# EasyEDA Pro project ProPrj_Devboard_V2_2025-07-15.epro, schematic Schematic1, sheets 4 to 7 of 7

## Sheets
4 P4: Create Date: 2025-06-23; Page Name: P4; Update Date: 2025-07-11
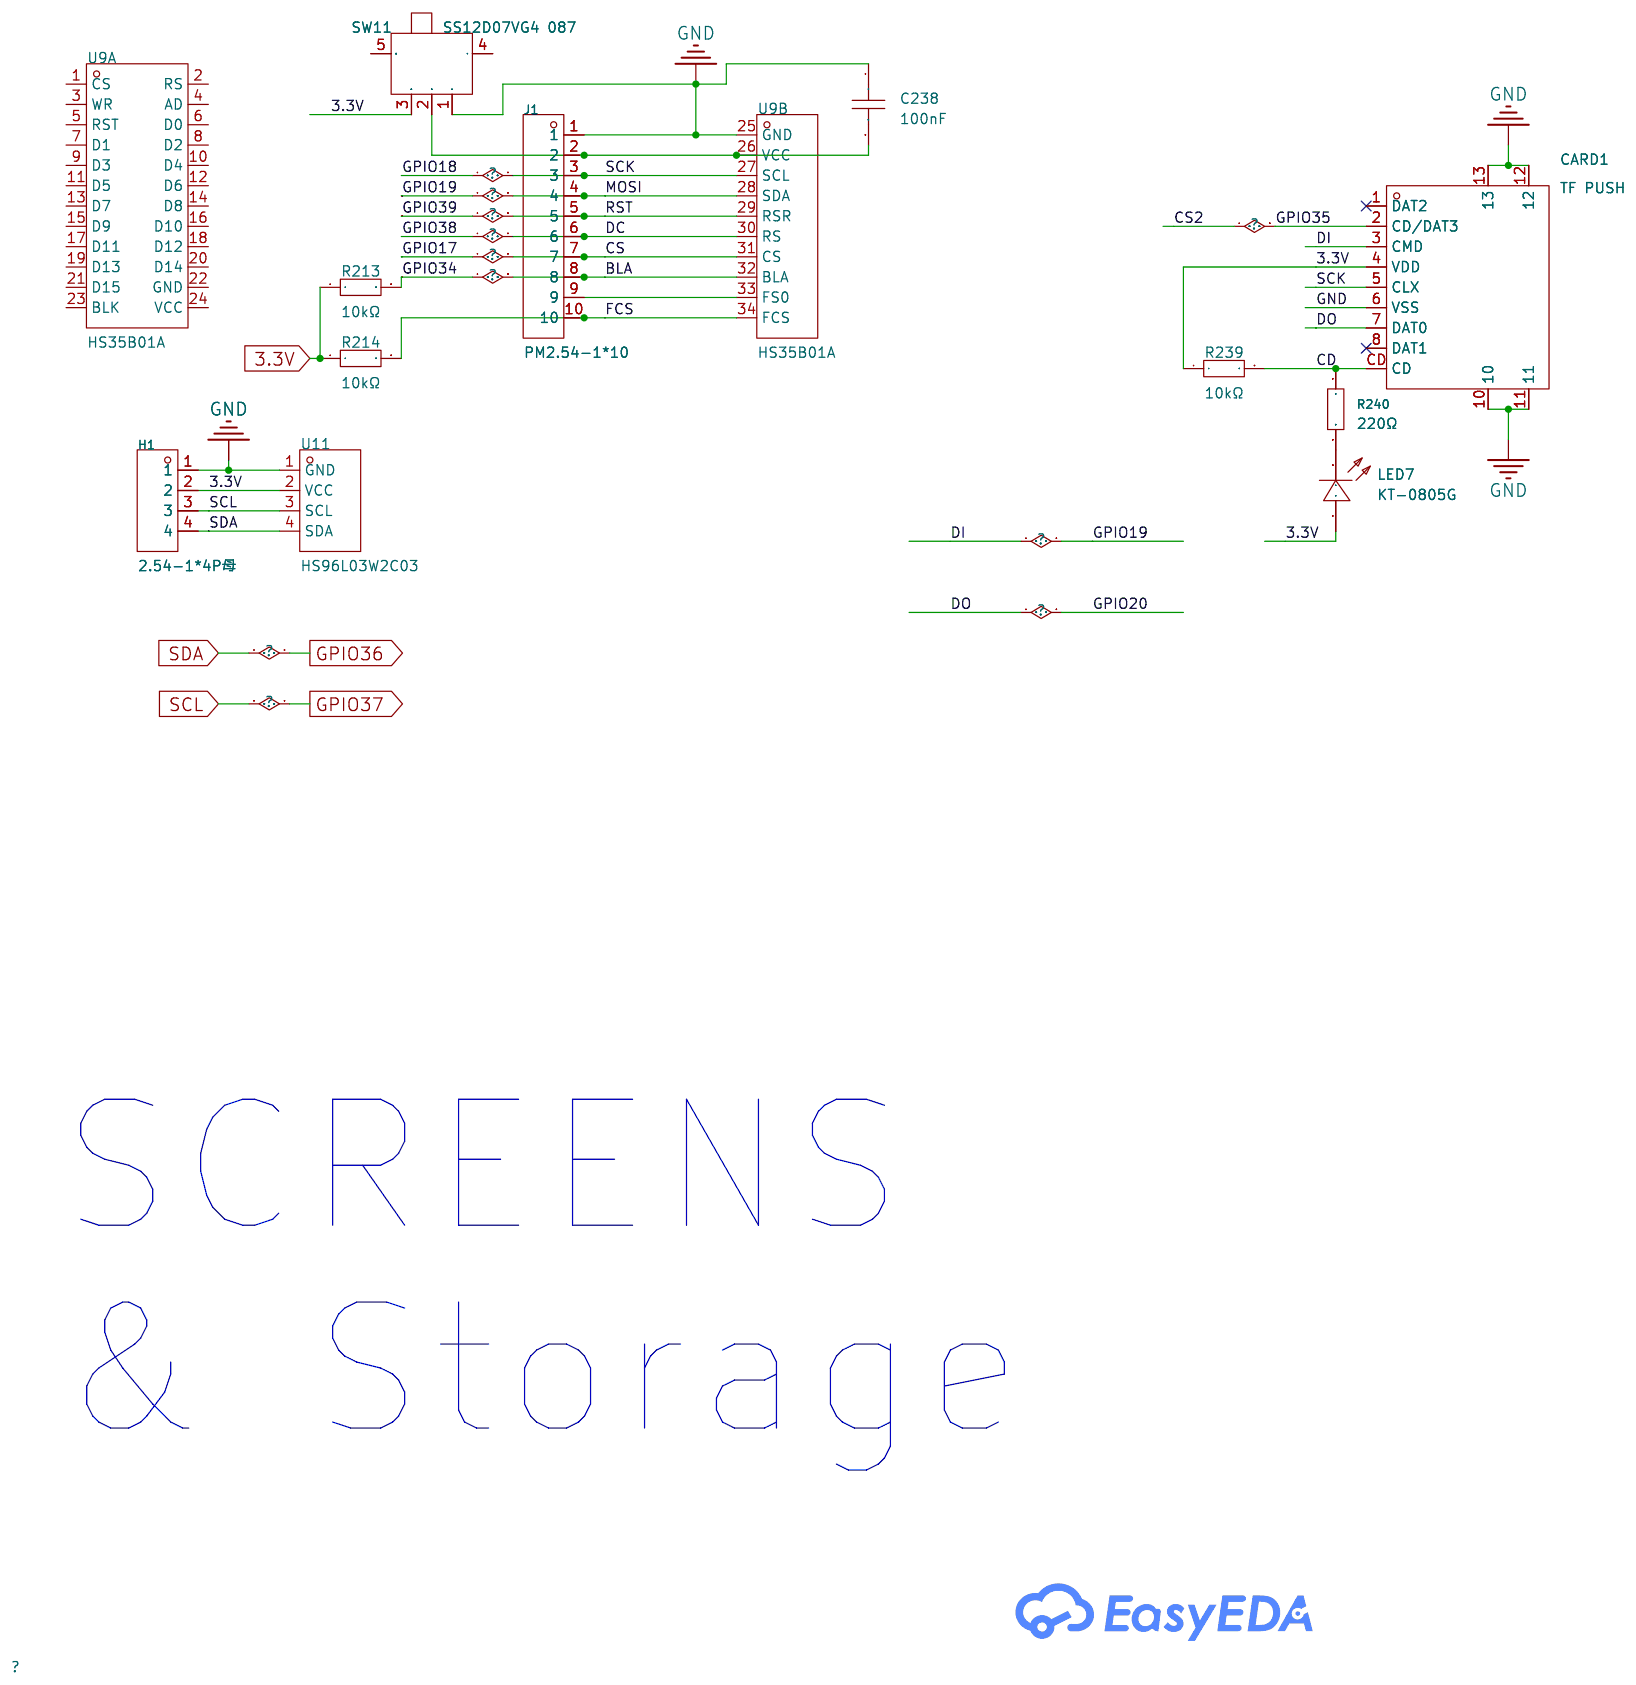
[diagram p3: P4]
5 P5: Create Date: 2025-06-27; Page Name: P5
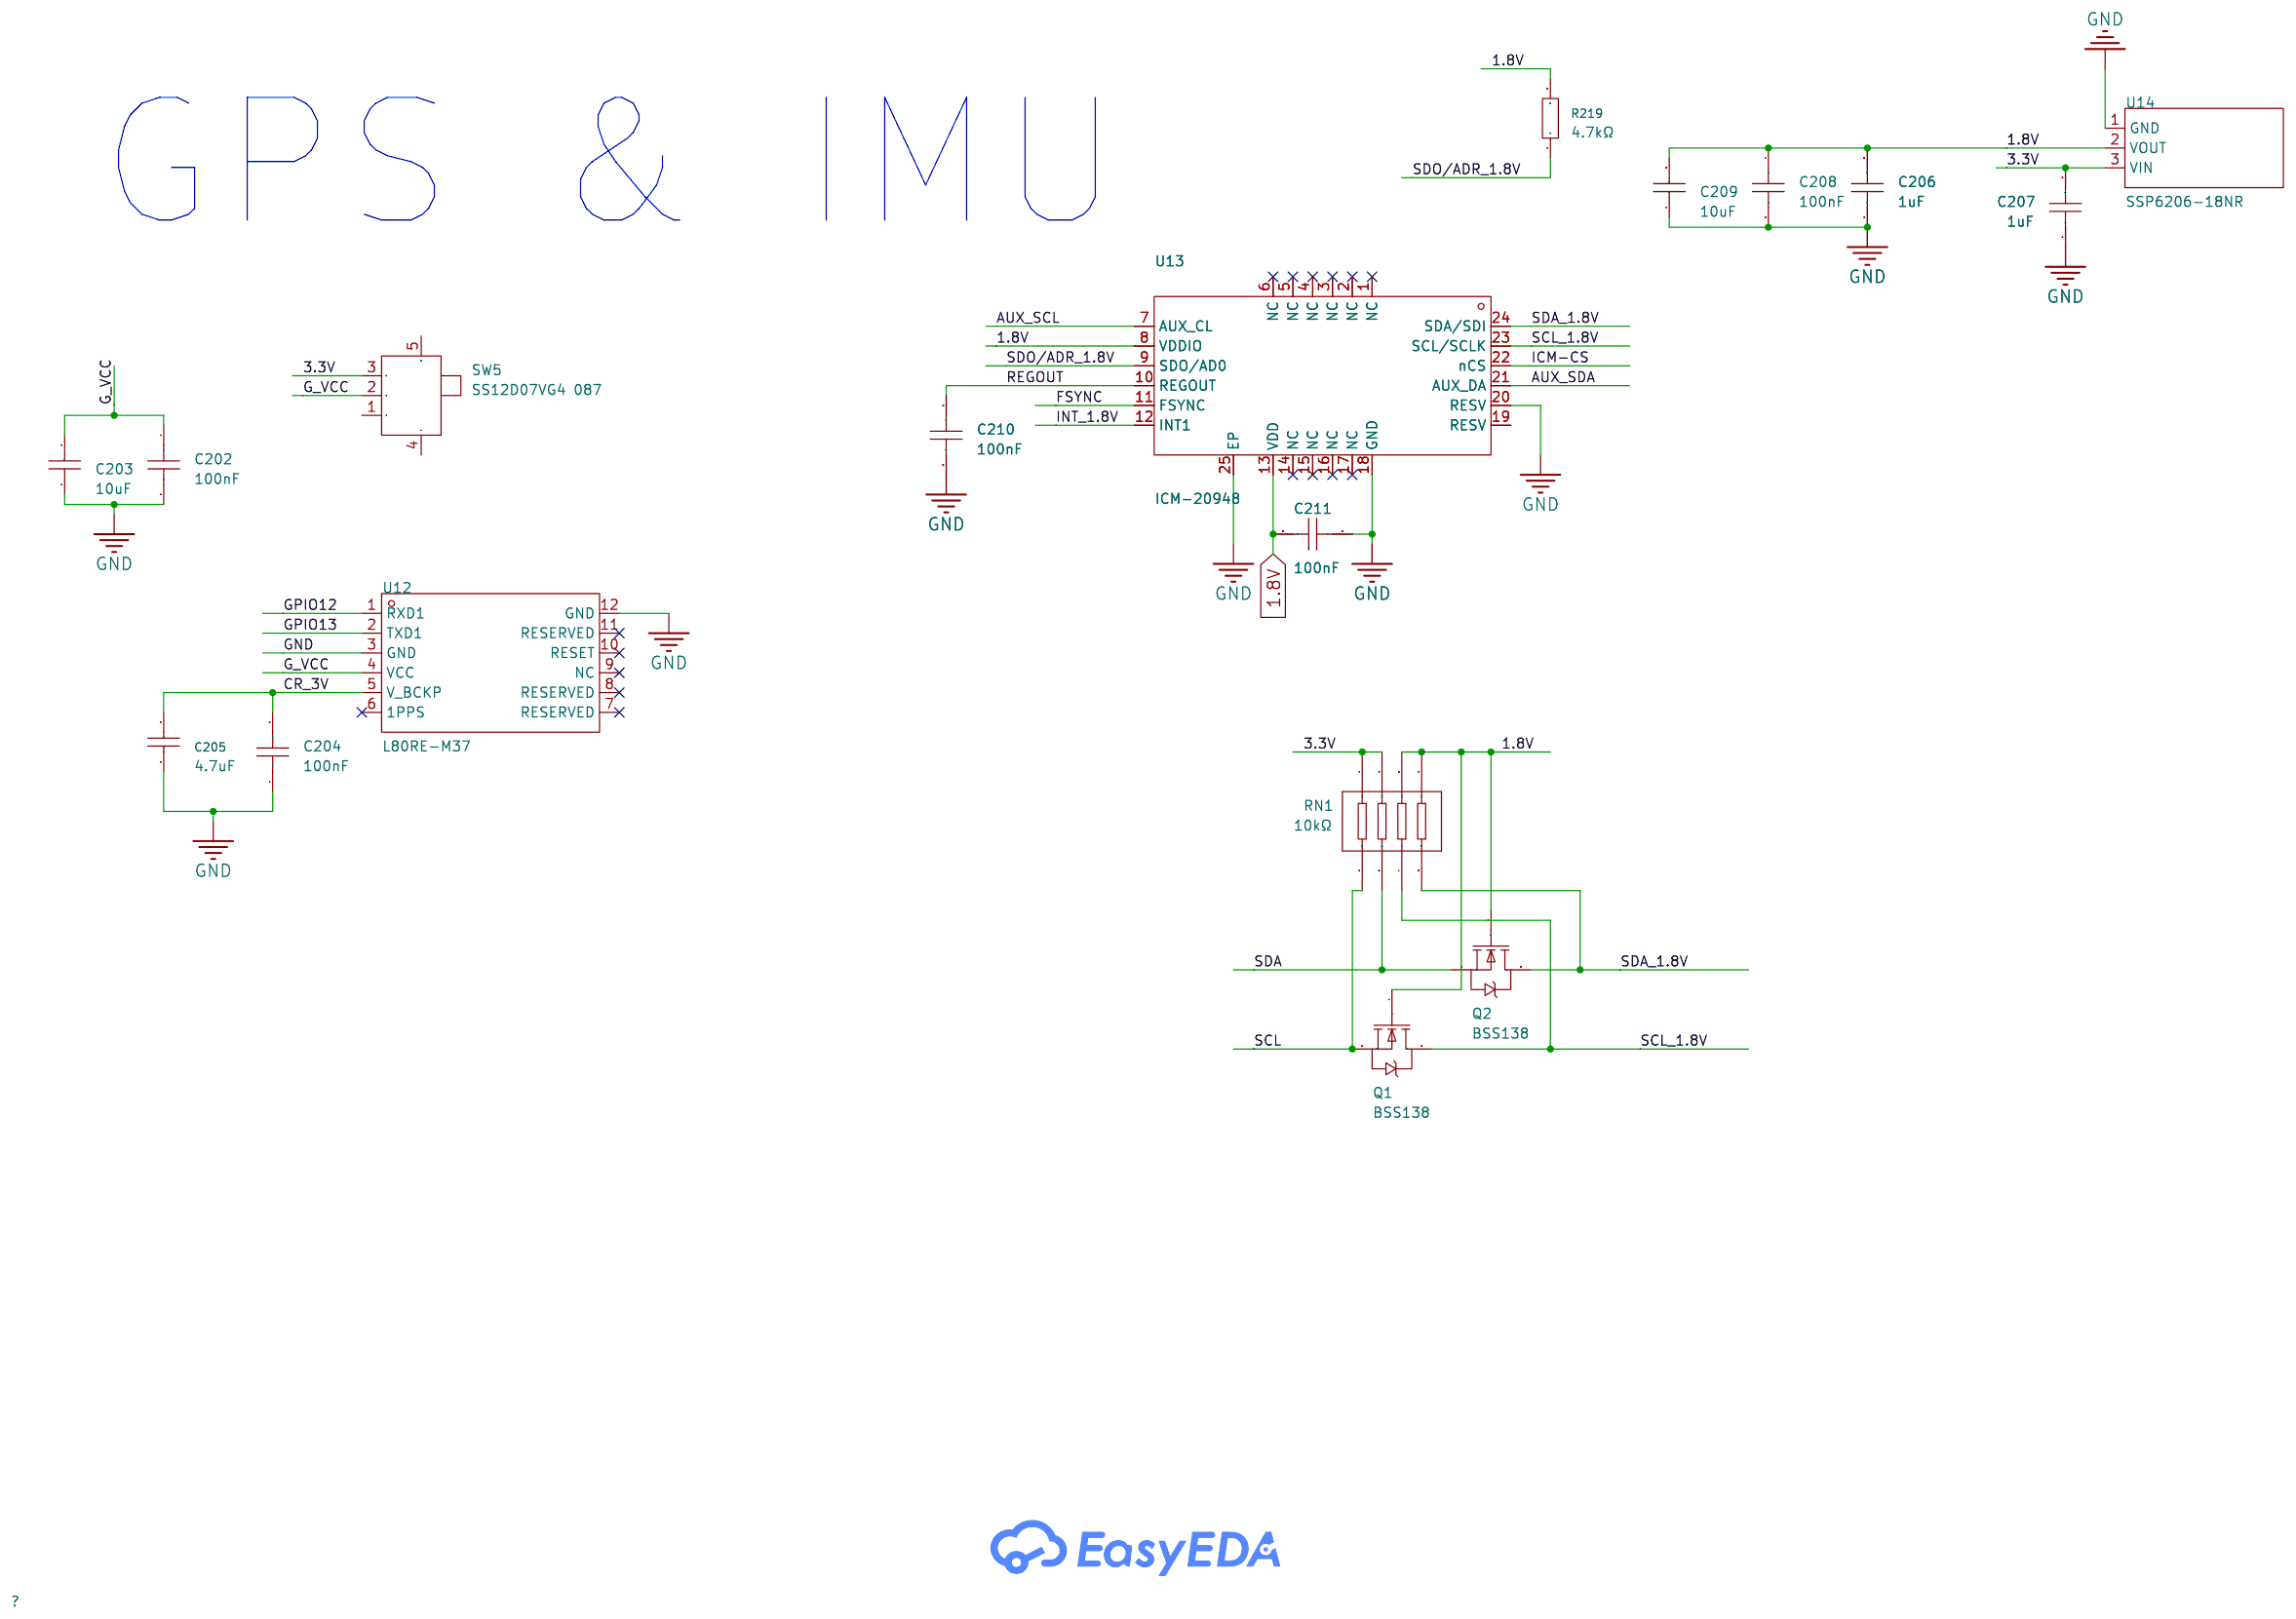
[diagram p4: P5]
6 P6: Create Date: 2025-07-08; Page Name: P6; Update Date: 2025-07-10
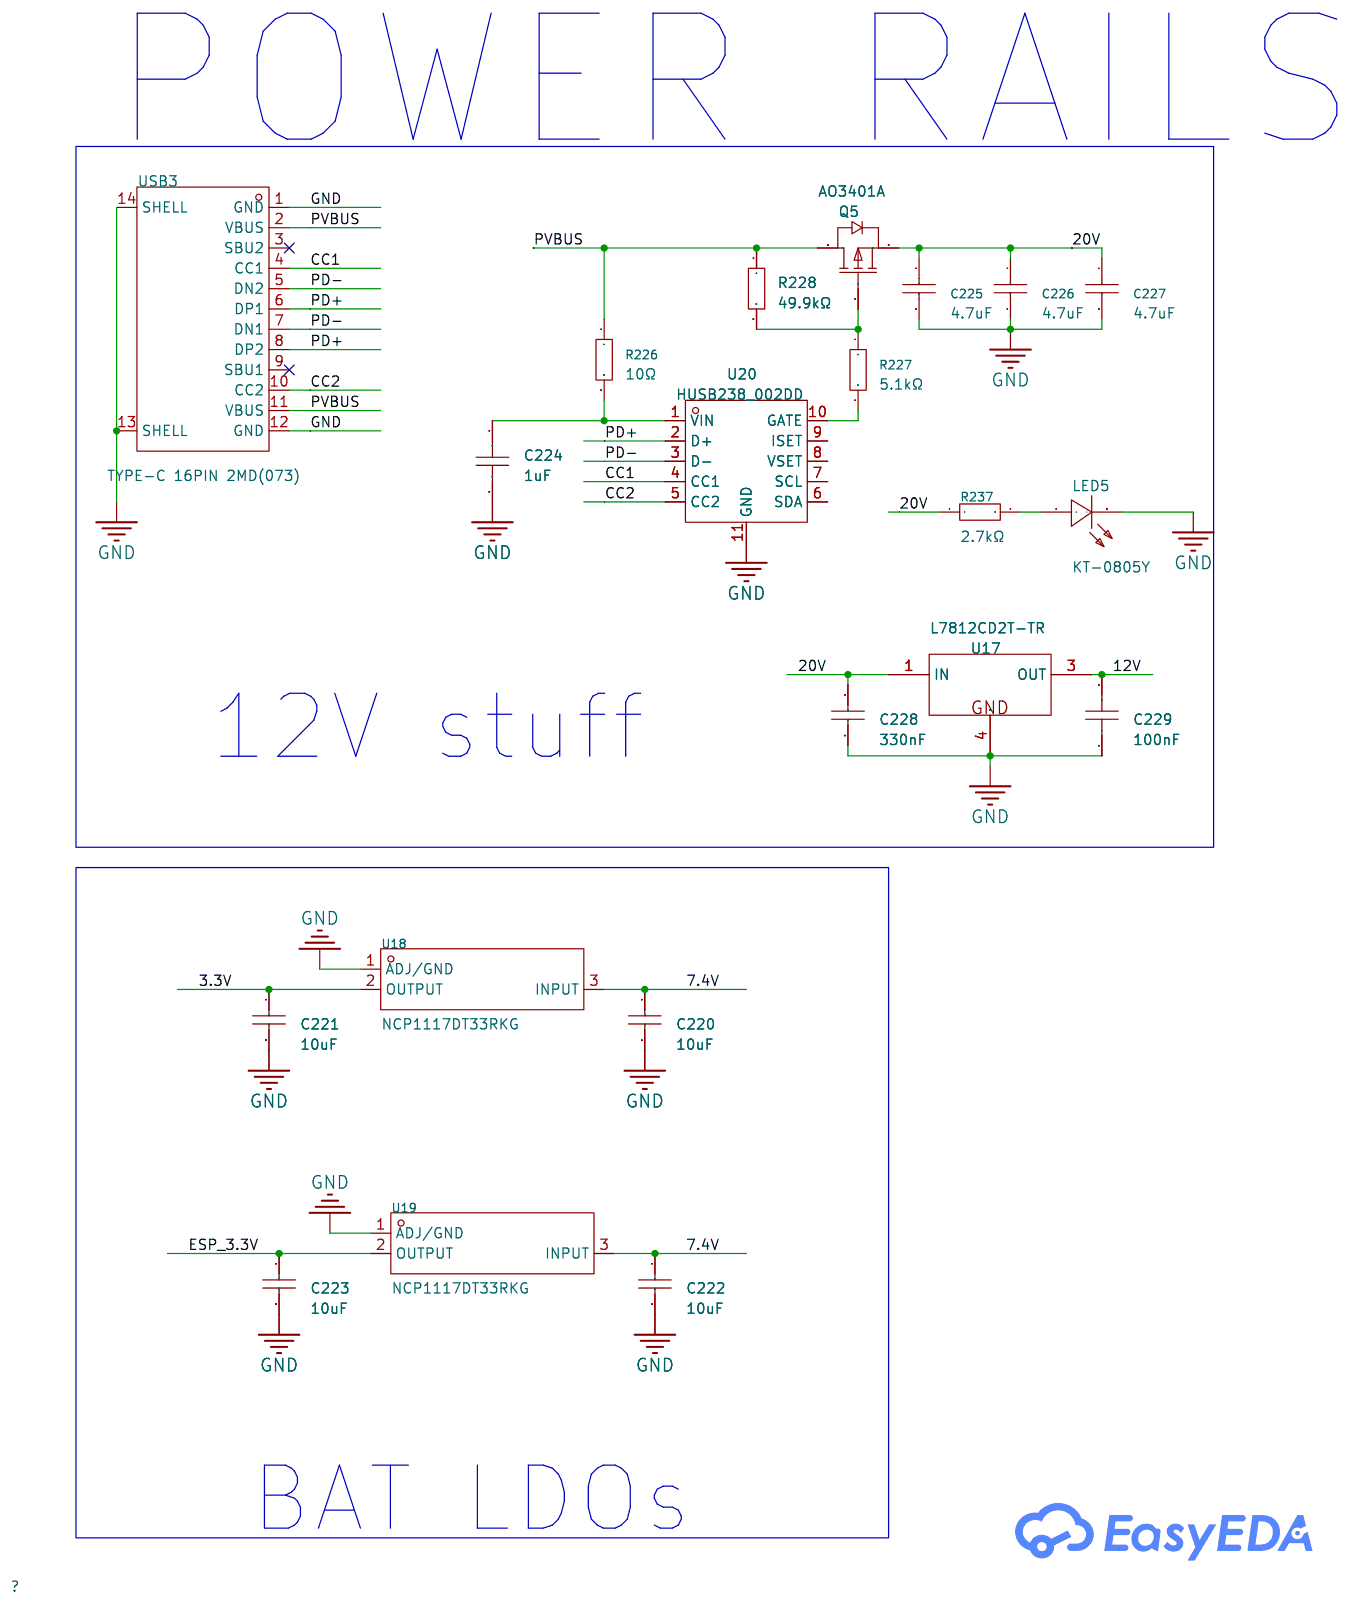
[diagram p5: P6]
7 P7: Create Date: 2025-07-10; Page Name: P7; Update Date: 2025-07-13
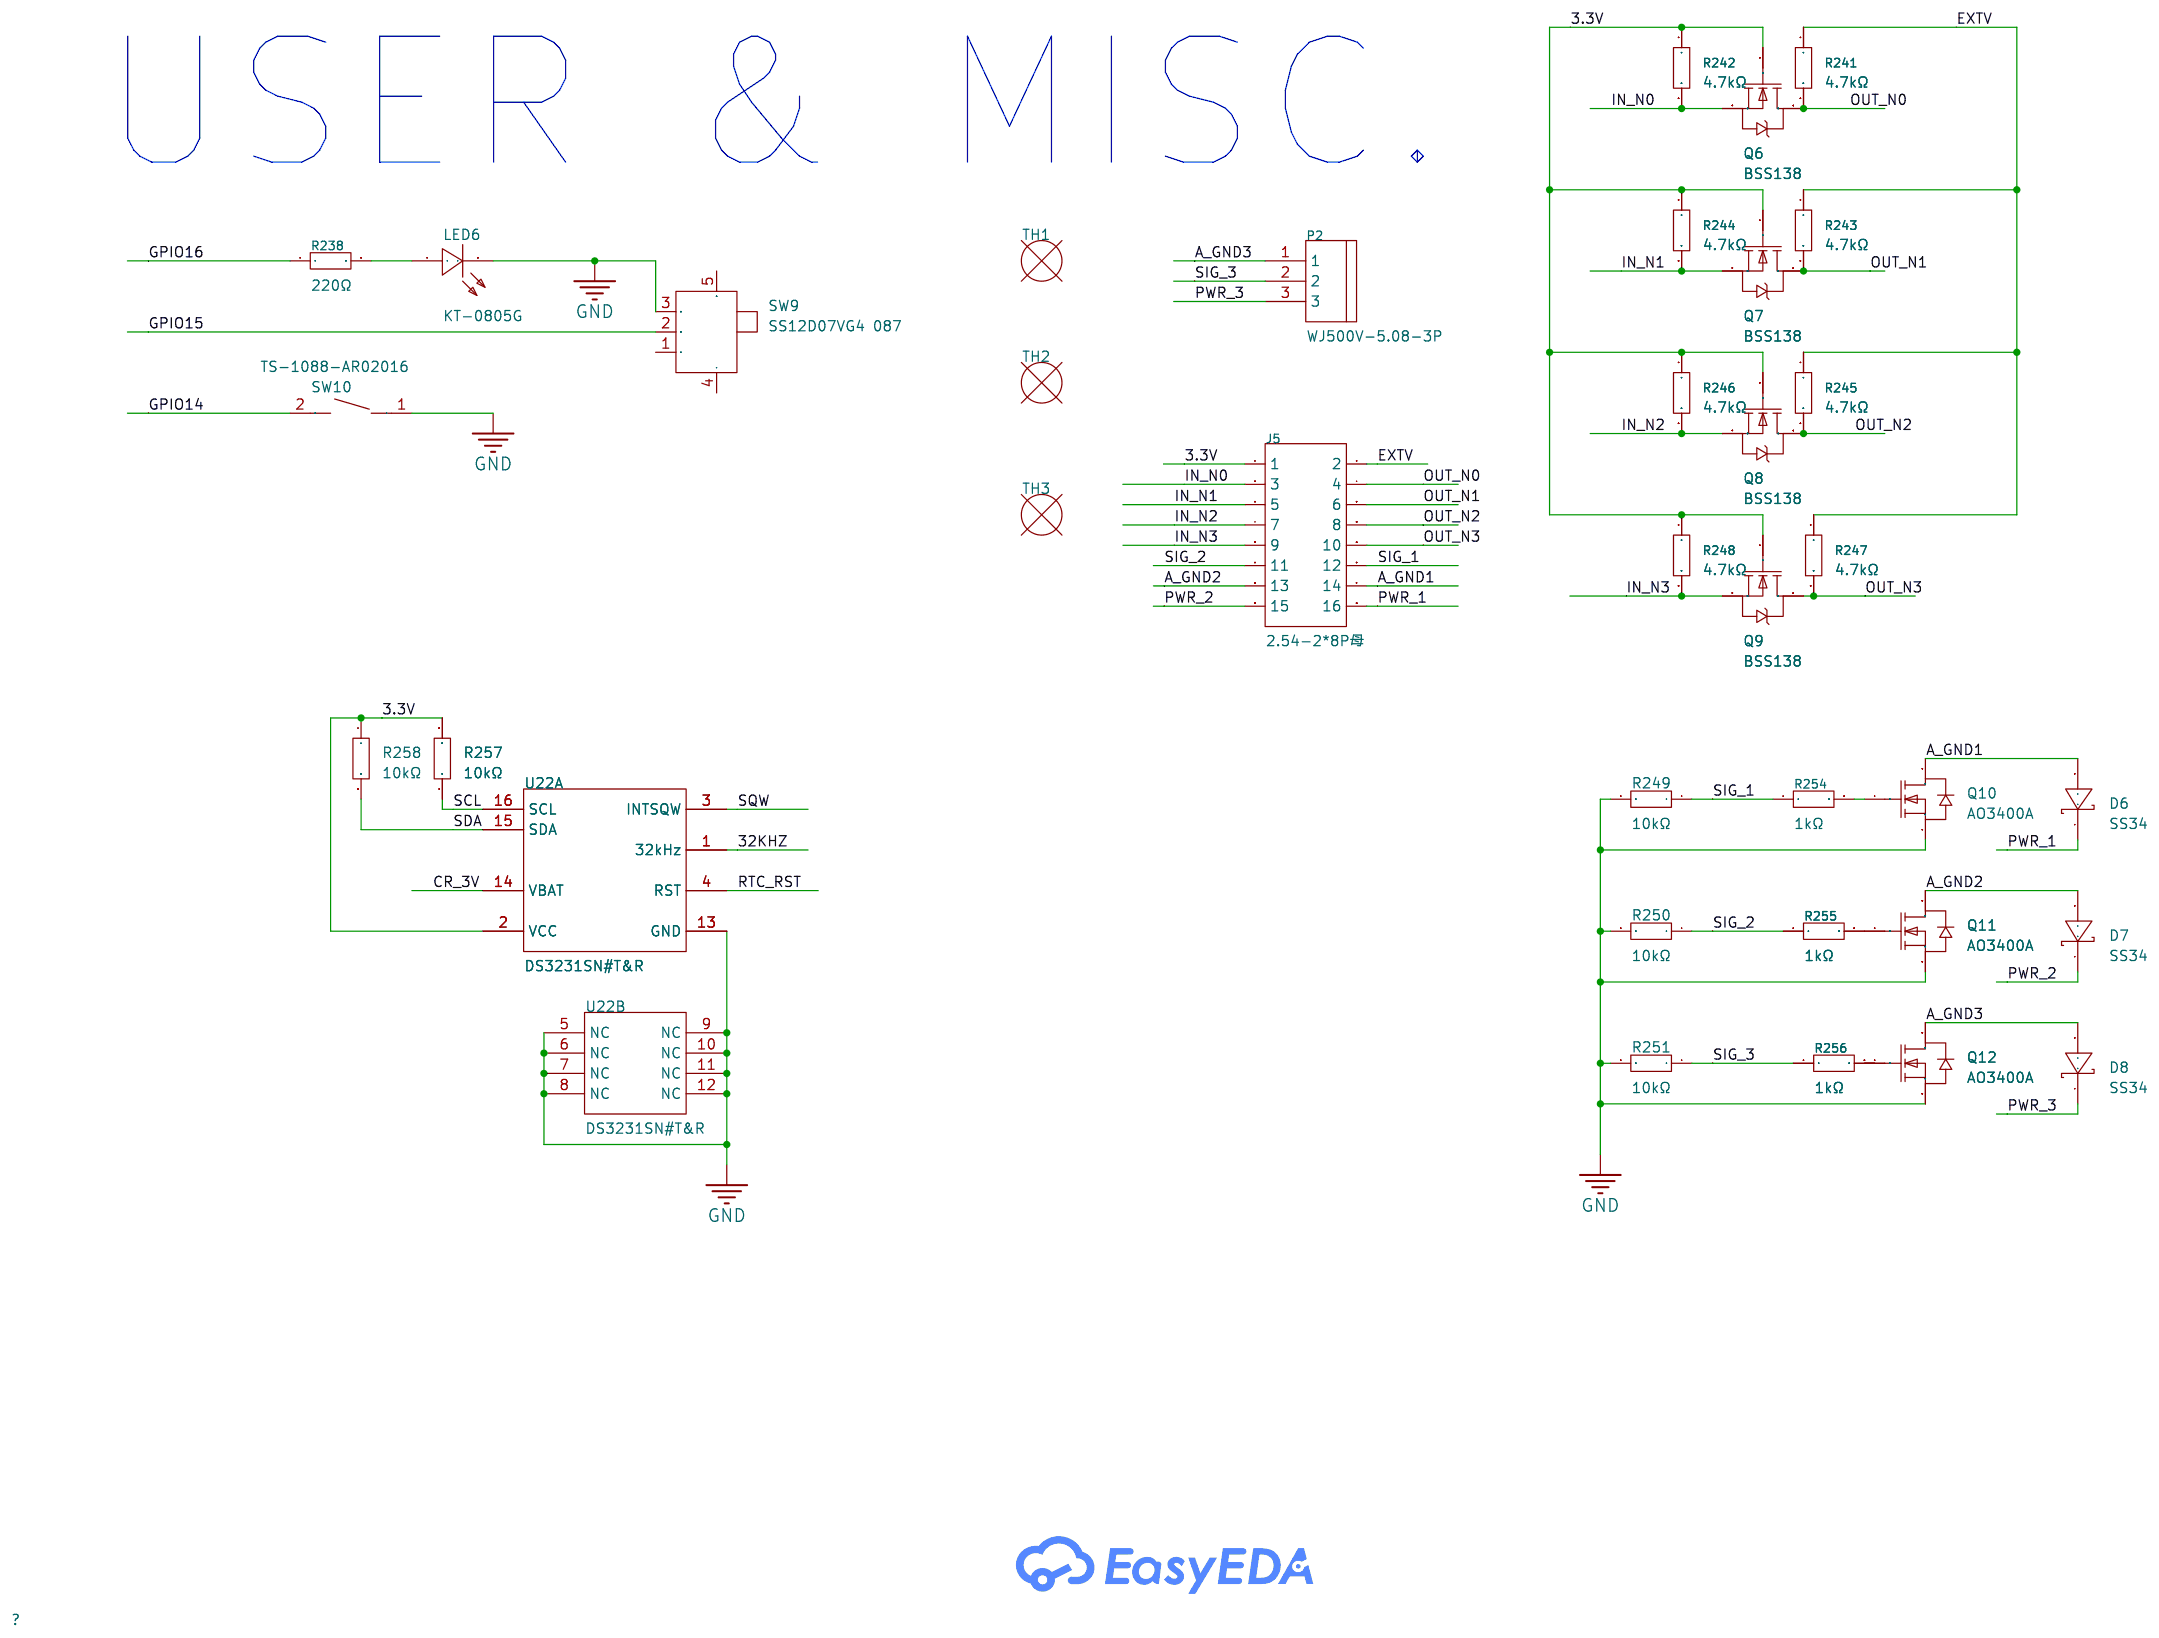
[diagram p6: P7]

## Parts
sheet P4
C238  100nF  [C0402]
CARD1  TF PUSH  [TF-SMD_TF-PUSH]
H1  2.54-1*4P母  [HDR-TH_4P-P2.54-V-F]
J1  PM2.54-1*10  [HDR-TH_10P-P2.54-V-F]
LED7  KT-0805G  [LED0805-R-RD]
R213  10kΩ  [R0402]
R214  10kΩ  [R0402]
R239  10kΩ  [R0402]
R240  220Ω  [R0603]
SW11  SS12D07VG4 087  [SW-TH_SS12D07VG4]
U9  HS35B01A  [LCD-TH_L96.5-W57.3_HS35B01A]  (sections 1,2)
U11  HS96L03W2C03  [OLED-TH_L27.8-W27.2-P2.54_C9900033791]
sheet P5
C202  100nF  [C0402]
C203  10uF  [C0402]
C204  100nF  [C0402]
C205  4.7uF  [C0402]
C206  1uF  [C0402]
C207  1uF  [C0402]
C208  100nF  [C0402]
C209  10uF  [C0402]
C210  100nF  [C0402]
C211  100nF  [C0402]
Q1  BSS138  [SOT-23-3_L2.9-W1.6-P1.90-LS2.8-BR]
Q2  BSS138  [SOT-23-3_L2.9-W1.6-P1.90-LS2.8-BR]
R219  4.7kΩ  [R0402]
RN1  10kΩ  [RES-ARRAY-SMD_0402-8P-L2.0-W1.0-BL]
SW5  SS12D07VG4 087  [SW-TH_SS12D07VG4]
U12  L80RE-M37  [GPSM-SMD_12P-L16.0-W16.0-P2.54-BL]
U13  ICM-20948  [QFN-24_L3.0-W3.0-P0.40-BL-EP]
U14  SSP6206-18NR  [SOT-23-3_L2.9-W1.3-P1.90-LS2.4-BR]
sheet P6
C220  10uF  [C0603]
C221  10uF  [C0402]
C222  10uF  [C0603]
C223  10uF  [C0402]
C224  1uF  [C0402]
C225  4.7uF  [C0805]
C226  4.7uF  [C0805]
C227  4.7uF  [C0805]
C228  330nF  [C0603]
C229  100nF  [C0402]
LED5  KT-0805Y  [LED0805-R-RD]
Q5  AO3401A  [SOT-23_L2.9-W1.3-P1.90-LS2.4-BR]
R226  10Ω  [R0402]
R227  5.1kΩ  [R0402]
R228  49.9kΩ  [R0402]
R237  2.7kΩ  [R0805]
U17  L7812CD2T-TR  [TO-263-2_L10.0-W9.1-P5.08-LS15.2-TL]
U18  NCP1117DT33RKG  [TO-252-2_L6.6-W6.1-P4.57-LS9.9-TL-CW]
U19  NCP1117DT33RKG  [TO-252-2_L6.6-W6.1-P4.57-LS9.9-TL-CW]
U20  HUSB238_002DD  [DFN-10_L3.0-W3.0-P0.50-BL-EP2.5]
USB3  TYPE-C 16PIN 2MD(073)  [USB-C-SMD_TYPE-C-6PIN-2MD-073]
sheet P7
D6  SS34  [SMA_L4.3-W2.6-LS5.2-RD]
D7  SS34  [SMA_L4.3-W2.6-LS5.2-RD]
D8  SS34  [SMA_L4.3-W2.6-LS5.2-RD]
J5  2.54-2*8P母  [HDR-TH_16P-P2.54-V-F-R2-C8-S2.54]
LED6  KT-0805G  [LED0805-R-RD]
P2  WJ500V-5.08-3P  [CONN-TH_3P-P5.00_WJ500V-5.08-3P]
Q6  BSS138  [SOT-23-3_L2.9-W1.6-P1.90-LS2.8-BR]
Q7  BSS138  [SOT-23-3_L2.9-W1.6-P1.90-LS2.8-BR]
Q8  BSS138  [SOT-23-3_L2.9-W1.6-P1.90-LS2.8-BR]
Q9  BSS138  [SOT-23-3_L2.9-W1.6-P1.90-LS2.8-BR]
Q10  AO3400A  [SOT-23-3_L2.9-W1.3-P1.90-LS2.4-BR]
Q11  AO3400A  [SOT-23-3_L2.9-W1.3-P1.90-LS2.4-BR]
Q12  AO3400A  [SOT-23-3_L2.9-W1.3-P1.90-LS2.4-BR]
R238  220Ω  [R0603]
R241  4.7kΩ  [R0402]
R242  4.7kΩ  [R0402]
R243  4.7kΩ  [R0402]
R244  4.7kΩ  [R0402]
R245  4.7kΩ  [R0402]
R246  4.7kΩ  [R0402]
R247  4.7kΩ  [R0402]
R248  4.7kΩ  [R0402]
R249  10kΩ  [R0402]
R250  10kΩ  [R0402]
R251  10kΩ  [R0402]
R254  1kΩ  [R0402]
R255  1kΩ  [R0402]
R256  1kΩ  [R0402]
R257  10kΩ  [R0402]
R258  10kΩ  [R0402]
SW9  SS12D07VG4 087  [SW-TH_SS12D07VG4]
SW10  TS-1088-AR02016  [SW-SMD_L3.9-W3.0-P4.45]
TH1  -  [TOOLING_HOLE_JLCPCB]  (no BOM)
TH2  -  [TOOLING_HOLE_JLCPCB]  (no BOM)
TH3  -  [TOOLING_HOLE_JLCPCB]  (no BOM)
U22  DS3231SN#T&R  [SOIC-16_L10.3-W7.5-P1.27-LS10.3-BL]  (sections 1,2)

## Library data of the parts
C202 C204 C208 C210 C211 C229 C238 = CL05B104KO5NNNC: Capacitance: Tolerance:±10% Tolerance:±10% Voltage Rated: Temperature Coefficient:; LCSC Part Name: 100nF ±10% 16V; Supplier Part: C1525; Manufacturer: SAMSUNG(三星); Supplier Footprint: 0402; JLCPCB Part Class: Basic Part; Datasheet: https://atta.szlcsc.com/upload/public/pdf/source/20160218/1457707763339.pdf; Supplier: LCSC; Tolerance: ±10%
CARD1 = TF PUSH: Card Connection Mode:Self-bouncing Card Type:MicroSD card (TF card) Connector Type:Card Slot Additional Card Detection Pins:None Supplementary Features:- Maximum Body Height:2mm Operating Temperature Range:-20℃~+90℃ Operating Temperature Range:-20℃~+90℃; LCSC Part Name: 自弹式 MicroSD卡(TF卡) 卡座; Supplier Part: C393941; Manufacturer: SHOU HAN(首韩); Supplier Footprint: SMD; JLCPCB Part Class: Extended Part; Datasheet: https://atta.szlcsc.com/upload/public/pdf/source/20191011/C393941_0DDD896EE907FEB750D8B7B8982E2A67.pdf; Supplier: LCSC; Card Connection Mode: Self-bouncing; Card Type: MicroSD card (TF card); Connector Type: Card Slot; Additional Card Detection Pins: None; Maximum Body Height: 2mm; Operating Temperature Range: -20℃~+90℃
H1 = 2.54-1*4P母: Holes Structure:1x4P Pitch:2.54mm Row Spacing:- Circular Hole / Square Hole:Square Holes Mounting Type:Straight Number of Rows:Plugin Number of Holes:4P Current Rating (Max):3A Voltage Rating (Max):- Holes Direction:Top Insulation Height:- Contact Materia; LCSC Part Name: 间距:2.54mm 1x4P 直插; Supplier Part: C2718488; Manufacturer: BOOMELE(博穆精密); Supplier Footprint: 插件,P=2.54mm; JLCPCB Part Class: Extended Part; Datasheet: https://atta.szlcsc.com/upload/public/pdf/source/20210301/C2718488_F4427B881E42CAA8DDB0B1C12B3A522C.pdf; Supplier: LCSC; Holes Structure: 1x4P; Pitch: 2.54mm; Circular Hole / Square Hole: Square Holes; Mounting Type: Straight; Number of Rows: Plugin; Number of Holes: 4P; Current Rating (Max): 3A; Holes Direction: Top; Contact Material: bronze; Operating Temperature Range: -40℃~+105℃
J1 = PM2.54-1*10: Holes Structure:1x10P Pitch:2.54mm Row Spacing:2.54mm Circular Hole / Square Hole:方孔 Mounting Type:Straight Number of Rows:Plugin Number of Holes:10P Current Rating (Max):2.5A Holes Direction:Top Insulation Height:8.5mm Operating Temperature Range:-40℃~+1; LCSC Part Name: 间距:2.54mm 1x10P 直插; Supplier Part: C5116489; Manufacturer: ZHOURI(洲日); Supplier Footprint: 插件,P=2.54mm; JLCPCB Part Class: Extended Part; Datasheet: https://atta.szlcsc.com/upload/public/pdf/source/20220803/0A90D5F6AD0A236C4C7DDEE7A7CA5EA3.pdf; Supplier: LCSC; Holes Structure: 1x10P; Pitch: 2.54mm; Row Spacing: 2.54mm; Circular Hole / Square Hole: 方孔; Mounting Type: Straight; Number of Rows: Plugin; Number of Holes: 10P; Current Rating (Max): 2.5A; Holes Direction: Top; Insulation Height: 8.5mm; Operating Temperature Range: -40℃~+105℃
LED6 LED7 = KT-0805G: Lamp Holder Type:- Emitted Color:Emerald Forward Voltage (VF):- Forward Voltage (VF):- Power Dissipation:- Forward Current:- Dominant Wavelength:- Dominant Wavelength:- Peak Wavelength:- Diode Configuration:- Lens Color:- Color Temperature:- Color Tempera; LCSC Part Name: 0805 翠绿 高亮; Supplier Part: C2297; Manufacturer: KENTO; Supplier Footprint: 0805; JLCPCB Part Class: Basic Part; Datasheet: https://atta.szlcsc.com/upload/public/pdf/source/20170209/1486607340485.pdf; Supplier: LCSC; Emitted Color: Emerald
R213 R214 R239 R249-R251 R257 R258 = 0402WGF1002TCE: Type:Thick Film Resistors Resistance:10kΩ Tolerance:±1% Tolerance:±1% Power(Watts): Overload Voltage (Max): Temperature Coefficient:±100ppm/℃ Temperature Coefficient:±100ppm/℃ Operating Temperature Range:-55℃~+155℃ Operating Temperature Range:-55℃~+155℃; LCSC Part Name: 10kΩ ±1% 62.5mW 厚膜电阻; Supplier Part: C25744; Manufacturer: UNI-ROYAL(厚声); Supplier Footprint: 0402; JLCPCB Part Class: Basic Part; Datasheet: https://atta.szlcsc.com/upload/public/pdf/source/20200306/C422600_1E6D84923E4A46A82E41ADD87F860B5C.pdf; Supplier: LCSC; Type: Thick Film Resistors; Tolerance: ±1%; Temperature Coefficient: ±100ppm/℃; Operating Temperature Range: -55℃~+155℃
R238 R240 = 0603WAF2200T5E: Type:Thick Film Resistors Resistance: Tolerance:±1% Tolerance:±1% Power(Watts): Overload Voltage (Max): Temperature Coefficient:±100ppm/℃ Temperature Coefficient:±100ppm/℃ Operating Temperature Range:-55℃~+155℃ Operating Temperature Range:-55℃~+155℃; LCSC Part Name: 220Ω ±1% 100mW 厚膜电阻; Supplier Part: C22962; Manufacturer: UNI-ROYAL(厚声); Supplier Footprint: 0603; JLCPCB Part Class: Basic Part; Datasheet: https://atta.szlcsc.com/upload/public/pdf/source/20200306/C422600_1E6D84923E4A46A82E41ADD87F860B5C.pdf; Supplier: LCSC; Type: Thick Film Resistors; Tolerance: ±1%; Temperature Coefficient: ±100ppm/℃; Operating Temperature Range: -55℃~+155℃
SW5 SW9 SW11 = SS12D07VG4 087: Circuit:SPDT Actuator Style:- Pin Style:PCPin Switch Length:8.7mm Switch Width:4.4mm Switch Height:4.7mm Mounting Style:Straight Actuator Color:- Current Rating (DC):500mA Voltage Rating (DC):50V Current Rating (AC):- Voltage Rating (AC):- Mechanical Life; Supplier Part: C2939726; Manufacturer: SHOU HAN(首韩); Supplier Footprint: 插件; JLCPCB Part Class: Extended Part; Datasheet: https://atta.szlcsc.com/upload/public/pdf/source/20220106/E715996F66241B9FD900079FF66489BE.pdf; Supplier: LCSC; Circuit: SPDT; Pin Style: PCPin; Switch Length: 8.7mm; Switch Width: 4.4mm; Switch Height: 4.7mm; Mounting Style: Straight; Current Rating (DC): 500mA; Voltage Rating (DC): 50V; Mechanical Life: 5千次; Operating Temperature: -10℃~+50℃
U9 = HS35B01A: Main Control Chip:ST7789 Size:3.5 Pixel Resolution:480x320; Supplier Part: C19632787; Manufacturer: HS(汉昇); JLCPCB Part Class: Extended Part; Datasheet: https://atta.szlcsc.com/upload/public/pdf/source/20231215/7EE0FD6E053FAA1097252AF5AF435390.pdf; Supplier: LCSC; Main Control Chip: ST7789; Size: 3.5; Pixel Resolution: 480x320
U11 = HS96L03W2C03: Main Control Chip:SSD1315 Interface Type:I2C Size:0.96 Pixel Resolution:128x64 Operating Temperature:-40℃~+70℃ Operating Temperature:-40℃~+70℃; LCSC Part Name: 0.96寸OLED显示屏窄白光IIC; Supplier Part: C5248080; Manufacturer: HS(汉昇); JLCPCB Part Class: Extended Part; Datasheet: https://atta.szlcsc.com/upload/public/pdf/source/20230627/763D01F79A90007632F098068C7C8AD9.pdf; Supplier: LCSC; Main Control Chip: SSD1315; Interface Type: I2C; Size: 0.96; Pixel Resolution: 128x64; Operating Temperature: -40℃~+70℃
C203 C209 C221 C223 = CL05A106MQ5NUNC: Capacitance: Tolerance:±20% Tolerance:±20% Voltage Rated: Temperature Coefficient:; LCSC Part Name: 10uF ±20% 6.3V; Supplier Part: C15525; Manufacturer: SAMSUNG(三星); Supplier Footprint: 0402; JLCPCB Part Class: Basic Part; Datasheet: https://atta.szlcsc.com/upload/public/pdf/source/20220823/2B02EE04F8F211D38A52DCB16EB6BEBA.pdf; Supplier: LCSC; Tolerance: ±20%
C205 = CL05A475MP5NRNC: Capacitance: Tolerance:±20% Tolerance:±20% Voltage Rated: Temperature Coefficient:; LCSC Part Name: 4.7uF ±20% 10V; Supplier Part: C23733; Manufacturer: SAMSUNG(三星); Supplier Footprint: 0402; JLCPCB Part Class: Basic Part; Datasheet: https://atta.szlcsc.com/upload/public/pdf/source/20160218/1457707763339.pdf; Supplier: LCSC; Tolerance: ±20%
C206 C207 C224 = CL05A105KA5NQNC: Capacitance: Tolerance:±10% Tolerance:±10% Voltage Rated: Temperature Coefficient:; LCSC Part Name: 1uF ±10% 25V; Supplier Part: C52923; Manufacturer: SAMSUNG(三星); Supplier Footprint: 0402; JLCPCB Part Class: Basic Part; Datasheet: https://atta.szlcsc.com/upload/public/pdf/source/20160218/1457707763339.pdf; Supplier: LCSC; Tolerance: ±10%
Q1 Q2 Q6-Q9 = BSS138_C52895: Type:1 N-Channel Drain Source Voltage (Vdss): Continuous Drain Current (Id):220mA Drain Source On Resistance (RDS(on)@Vgs,Id):3.5Ω@10V,0.22A Power Dissipation (Pd):360mW Gate Threshold Voltage (Vgs(th)@Id):1.5V@1mA Total Gate Charge (Qg@Vgs):2.4nC@25V Inp; LCSC Part Name: 1个N沟道 耐压:50V 电流:220mA; Supplier Part: C52895; Manufacturer: onsemi(安森美); Supplier Footprint: SOT-23; JLCPCB Part Class: Extended Part; Datasheet: https://atta.szlcsc.com/upload/public/pdf/source/20170412/1491969107299.pdf; Supplier: LCSC; Type: 1 N-Channel; Continuous Drain Current (Id): 220mA; Drain Source On Resistance (RDS(on)@Vgs,Id): 3.5Ω@10V,0.22A; Power Dissipation (Pd): 360mW; Gate Threshold Voltage (Vgs(th)@Id): 1.5V@1mA; Total Gate Charge (Qg@Vgs): 2.4nC@25V; Input Capacitance (Ciss@Vds): 27pF@25V; Reverse Transfer Capacitance (Crss@Vds): 6pF; Operating Temperature: -55℃~+150℃
R219 R241-R248 = 0402WGF4701TCE: Type:Thick Film Resistors Resistance:4.7kΩ Tolerance:±1% Tolerance:±1% Power(Watts): Overload Voltage (Max): Temperature Coefficient:±100ppm/℃ Temperature Coefficient:±100ppm/℃ Operating Temperature Range:-55℃~+155℃ Operating Temperature Range:-55℃~+155℃; LCSC Part Name: 4.7kΩ ±1% 62.5mW 厚膜电阻; Supplier Part: C25900; Manufacturer: UNI-ROYAL(厚声); Supplier Footprint: 0402; JLCPCB Part Class: Basic Part; Datasheet: https://atta.szlcsc.com/upload/public/pdf/source/20200306/C422600_1E6D84923E4A46A82E41ADD87F860B5C.pdf; Supplier: LCSC; Type: Thick Film Resistors; Tolerance: ±1%; Temperature Coefficient: ±100ppm/℃; Operating Temperature Range: -55℃~+155℃
RN1 = 4D02WGJ0103TCE: Number of Resistors: Resistance:10kΩ Tolerance:±5% Tolerance:±5% Power(Watts): Temperature Coefficient:±200ppm/℃ Temperature Coefficient:±200ppm/℃ Number of Pins:; LCSC Part Name: 10kΩ ±5%; Supplier Part: C25725; Manufacturer: UNI-ROYAL(厚声); Supplier Footprint: 0402x4; JLCPCB Part Class: Extended Part; Datasheet: https://atta.szlcsc.com/upload/public/pdf/source/20191224/C474318_2527498AE30E813171187CCD28401A71.pdf; Supplier: LCSC; Tolerance: ±5%; Temperature Coefficient: ±200ppm/℃
U12 = L80RE-M37: Operating Supply Voltage:3V~4.3V Operating Supply Voltage:3V~4.3V Sensitivity:-165dBm Sensitivity:-165dBm Operating Temperature:-40℃~+85℃ Operating Temperature:-40℃~+85℃; LCSC Part Name: GPS模块; Supplier Part: C3029061; Manufacturer: Quectel(移远); Supplier Footprint: SMD-12P; JLCPCB Part Class: Extended Part; Datasheet: https://atta.szlcsc.com/upload/public/pdf/source/20220527/3A05E11B37A3891E2217B4B1159372B8.pdf; Supplier: LCSC; Operating Supply Voltage: 3V~4.3V; Sensitivity: -165dBm; Operating Temperature: -40℃~+85℃
U13 = ICM-20948: Sensor Type:Accelerometer gyroscope Operating Temperature:-40℃~+85℃ Operating Temperature:-40℃~+85℃; Supplier Part: C726001; Manufacturer: TDK InvenSense(应美盛); Supplier Footprint: QFN-24(3x3); JLCPCB Part Class: Extended Part; Datasheet: https://atta.szlcsc.com/upload/public/pdf/source/20210715/C726001_EFE09342631EBC06FA98BEAE6CEEEE9D.pdf; Supplier: LCSC; Sensor Type: Accelerometer gyroscope; Operating Temperature: -40℃~+85℃
U14 = SSP6206-18NR: Output Type:Fixed Voltage - Supply:8V Output Voltage:1.8V Output Voltage:1.8V Output Current:300mA Power Supply Rejection Ratio (PSRR):50dB@(1kHz) Voltage Dropout:420mV@(100mA) Output Configuration:Positive electrode Number of Outputs:1; LCSC Part Name: 输入8V 输出1.8V 300mA; Supplier Part: C277878; Manufacturer: Siproin(上海矽朋); Supplier Footprint: SOT-23; JLCPCB Part Class: Extended Part; Datasheet: https://atta.szlcsc.com/upload/public/pdf/source/20240407/6D2F72AFACB8BAEC20CCC024846FBA04.pdf; Supplier: LCSC; Output Type: Fixed; Voltage - Supply: 8V; Output Voltage: 1.8V; Output Current: 300mA; Power Supply Rejection Ratio (PSRR): 50dB@(1kHz); Voltage Dropout: 420mV@(100mA); Output Configuration: Positive electrode; Number of Outputs: 1
C220 C222 = CL10A106MA8NRNC: Capacitance: Tolerance:±20% Tolerance:±20% Voltage Rated: Temperature Coefficient:; LCSC Part Name: 10uF ±20% 25V; Supplier Part: C96446; Manufacturer: SAMSUNG(三星); Supplier Footprint: 0603; JLCPCB Part Class: Basic Part; Datasheet: https://atta.szlcsc.com/upload/public/pdf/source/20160218/1457707763339.pdf; Supplier: LCSC; Tolerance: ±20%
C225-C227 = CL21A475KAQNNNE: Capacitance: Tolerance:±10% Tolerance:±10% Voltage Rated: Temperature Coefficient:; LCSC Part Name: 4.7uF ±10% 25V; Supplier Part: C1779; Manufacturer: SAMSUNG(三星); Supplier Footprint: 0805; JLCPCB Part Class: Basic Part; Datasheet: https://atta.szlcsc.com/upload/public/pdf/source/20160218/1457707763339.pdf; Supplier: LCSC; Tolerance: ±10%
C228 = 0603B334K250NT: Capacitance:330nF Tolerance:±10% Tolerance:±10% Voltage Rating:25V Temperature Coefficient:X7R; LCSC Part Name: 330nF ±10% 25V; Supplier Part: C1615; Manufacturer: FH(风华); Supplier Footprint: 0603; JLCPCB Part Class: Extended Part; Datasheet: https://atta.szlcsc.com/upload/public/pdf/source/20200305/C486355_26A10D38EF8C2A5C37091D0039909270.pdf; Supplier: LCSC; Tolerance: ±10%; Voltage Rating: 25V; Temperature Coefficient: X7R
LED5 = KT-0805Y: Emitted Color:Yellow Power Dissipation:- Forward Current:- Dominant Wavelength:- Dominant Wavelength:- Peak Wavelength:- Diode Configuration:- Lens Color:- Color Temperature:- Color Temperature:- Viewing Angle:- Mounting Sytle:- Operating Temperature:- Op; LCSC Part Name: 0805 黄灯 高亮; Supplier Part: C2296; Manufacturer: KENTO; Supplier Footprint: 0805; JLCPCB Part Class: Basic Part; Datasheet: https://atta.szlcsc.com/upload/public/pdf/source/20160421/1461205044170.pdf; Supplier: LCSC; Emitted Color: Yellow
Q5 = AO3401A_C15127: Type:1 Piece P-Channel Drain Source Voltage (Vdss): Continuous Drain Current (Id): Drain Source On Resistance (RDS(on)@Vgs,Id):44mΩ@10V,4.3A Power Dissipation (Pd): Gate Threshold Voltage (Vgs(th)@Id):1.3V@250uA Total Gate Charge (Qg@Vgs):12.2nC@4.5V Inpu; LCSC Part Name: 1个P沟道 耐压:30V 电流:4A; Supplier Part: C15127; Manufacturer: AOS; Supplier Footprint: SOT-23; JLCPCB Part Class: Basic Part; Datasheet: https://atta.szlcsc.com/upload/public/pdf/source/20160507/1462613609053.pdf; Supplier: LCSC; Type: 1 Piece P-Channel; Drain Source On Resistance (RDS(on)@Vgs,Id): 44mΩ@10V,4.3A; Gate Threshold Voltage (Vgs(th)@Id): 1.3V@250uA; Total Gate Charge (Qg@Vgs): 12.2nC@4.5V; Input Capacitance (Ciss@Vds): 1.2nF@15V; Operating Temperature: -55℃~+150℃@(Tj)
R226 = 0402WGF100JTCE: Type:Thick Film Resistors Resistance:10Ω Tolerance:±1% Tolerance:±1% Power(Watts): Overload Voltage (Max): Temperature Coefficient:±200ppm/℃ Temperature Coefficient:±200ppm/℃ Operating Temperature Range:-55℃~+155℃ Operating Temperature Range:-55℃~+155℃; LCSC Part Name: 10Ω ±1% 62.5mW 厚膜电阻; Supplier Part: C25077; Manufacturer: UNI-ROYAL(厚声); Supplier Footprint: 0402; JLCPCB Part Class: Basic Part; Datasheet: https://atta.szlcsc.com/upload/public/pdf/source/20200306/C422600_1E6D84923E4A46A82E41ADD87F860B5C.pdf; Supplier: LCSC; Type: Thick Film Resistors; Tolerance: ±1%; Temperature Coefficient: ±200ppm/℃; Operating Temperature Range: -55℃~+155℃
R227 = 0402WGF5101TCE: Type:Thick Film Resistors Resistance:5.1kΩ Tolerance:±1% Tolerance:±1% Power(Watts): Overload Voltage (Max): Temperature Coefficient:±100ppm/℃ Temperature Coefficient:±100ppm/℃ Operating Temperature Range:-55℃~+155℃ Operating Temperature Range:-55℃~+155℃; LCSC Part Name: 5.1kΩ ±1% 62.5mW 厚膜电阻; Supplier Part: C25905; Manufacturer: UNI-ROYAL(厚声); Supplier Footprint: 0402; JLCPCB Part Class: Basic Part; Datasheet: https://atta.szlcsc.com/upload/public/pdf/source/20200306/C422600_1E6D84923E4A46A82E41ADD87F860B5C.pdf; Supplier: LCSC; Type: Thick Film Resistors; Tolerance: ±1%; Temperature Coefficient: ±100ppm/℃; Operating Temperature Range: -55℃~+155℃
R228 = 0402WGF4992TCE: Type:Thick Film Resistors Resistance:49.9kΩ Tolerance:±1% Tolerance:±1% Power(Watts): Overload Voltage (Max): Temperature Coefficient:±100ppm/℃ Temperature Coefficient:±100ppm/℃ Operating Temperature Range:-55℃~+155℃ Operating Temperature Range:-55℃~+155℃; LCSC Part Name: 49.9kΩ ±1% 62.5mW 厚膜电阻; Supplier Part: C25897; Manufacturer: UNI-ROYAL(厚声); Supplier Footprint: 0402; JLCPCB Part Class: Extended Part; Datasheet: https://atta.szlcsc.com/upload/public/pdf/source/20200306/C422600_1E6D84923E4A46A82E41ADD87F860B5C.pdf; Supplier: LCSC; Type: Thick Film Resistors; Tolerance: ±1%; Temperature Coefficient: ±100ppm/℃; Operating Temperature Range: -55℃~+155℃
R237 = 0805W8F2701T5E: Type:Thick Film Resistors Resistance:2.7kΩ Tolerance:±1% Tolerance:±1% Power(Watts): Overload Voltage (Max): Temperature Coefficient:±100ppm/℃ Temperature Coefficient:±100ppm/℃ Operating Temperature Range:-55℃~+155℃ Operating Temperature Range:-55℃~+155℃; LCSC Part Name: 2.7kΩ ±1% 125mW 厚膜电阻; Supplier Part: C17530; Manufacturer: UNI-ROYAL(厚声); Supplier Footprint: 0805; JLCPCB Part Class: Basic Part; Datasheet: https://atta.szlcsc.com/upload/public/pdf/source/20200306/C422600_1E6D84923E4A46A82E41ADD87F860B5C.pdf; Supplier: LCSC; Type: Thick Film Resistors; Tolerance: ±1%; Temperature Coefficient: ±100ppm/℃; Operating Temperature Range: -55℃~+155℃
U17 = L7812CD2T-TR: Output Type:Fixed Maximum Input Voltage:35V Output Voltage:12V Output Voltage:12V Output Current:1.5A Power Supply Rejection Ratio (PSRR):55dB@(120Hz) Dropout Voltage:2V@(1A) standby current:8mA Feature:Short-Circuit  Protection；Thermal Protection(TSD)；Ov; LCSC Part Name: 正稳压器IC; Supplier Part: C13456; Manufacturer: ST(意法半导体); Supplier Footprint: TO-263-2; JLCPCB Part Class: Extended Part; Datasheet: https://atta.szlcsc.com/upload/public/pdf/source/20140724/1457707158226.pdf; Supplier: LCSC; Output Type: Fixed; Maximum Input Voltage: 35V; Output Voltage: 12V; Output Current: 1.5A; Power Supply Rejection Ratio (PSRR): 55dB@(120Hz); Dropout Voltage: 2V@(1A); standby current: 8mA; Feature: Short-Circuit  Protection；Thermal Protection(TSD)；Overcurrent Protection(OCP); Operating Temperature: 0℃~+125℃; Output Polarity: Positive electrode; Number of Outputs: 1
U18 U19 = NCP1117DT33RKG: Output Type: Maximum Input Voltage:20V Output Voltage:3.3V Output Voltage:3.3V MAX Output Current:1A Power Supply Rejection Ratio (PSRR):64dB@(120Hz) Dropout Voltage:1.2V@(800mA) standby current:10mA Operating Temperature:0℃~+125℃ Operating Temperature:0℃; LCSC Part Name: 输入20V 输出3.3V 1A; Supplier Part: C88234; Manufacturer: onsemi(安森美); Supplier Footprint: TO-252-2(DPAK); JLCPCB Part Class: Extended Part; Datasheet: https://atta.szlcsc.com/upload/public/pdf/source/20180713/C233237_751C9E9ABCFEB70C62A2D3109B40BDA0.pdf; Supplier: LCSC; Maximum Input Voltage: 20V; Output Voltage: 3.3V; MAX Output Current: 1A; Power Supply Rejection Ratio (PSRR): 64dB@(120Hz); Dropout Voltage: 1.2V@(800mA); standby current: 10mA; Operating Temperature: 0℃~+125℃; Output Polarity: Positive electrode; Number of Outputs: 1
U20 = HUSB238_002DD: Supplier Part: C7471904; Manufacturer: Hynetek(慧能泰); Supplier Footprint: DFN-10L(3x3); JLCPCB Part Class: Extended Part; Datasheet: https://atta.szlcsc.com/upload/public/pdf/source/20240407/14E2BCB22C39B22B34E48E1B6FC2FE3E.pdf; Supplier: LCSC
USB3 = TYPE-C 16PIN 2MD(073): Connector Type:Type-C Standard:USB 3.1 Gender:Female Mounting Style:Horizontal attachment Number of Contacts:16P Number of Ports:1 Current Rating - Power (Max):5A Operating Temperature Range:-25℃~+85℃ Operating Temperature Range:-25℃~+85℃ Rated Voltage (M; LCSC Part Name: Type-C 母 卧贴; Supplier Part: C2765186; Manufacturer: SHOU HAN(首韩); Supplier Footprint: SMD; JLCPCB Part Class: Extended Part; Datasheet: https://atta.szlcsc.com/upload/public/pdf/source/20211123/39B17C16241EAC15C5E277BDA434118E.pdf; Supplier: LCSC; Connector Type: Type-C; Standard: USB 3.1; Gender: Female; Mounting Style: Horizontal attachment; Number of Contacts: 16P; Number of Ports: 1; Current Rating - Power (Max): 5A; Operating Temperature Range: -25℃~+85℃; Rated Voltage (Max): 5V; Connect-Disconnect Life: 5000 Cuts; Core Colour: Black
D6-D8 = SS34_C8678: Diode Configuration:Independent Type Forward Voltage (Vf@If):550mV@3A Reverse Voltage (Vr):40V Rectified Current:3A Reverse Leakage Current (Ir):500uA@40V; LCSC Part Name: 电压:40V 电流:3A; Supplier Part: C8678; Manufacturer: MDD(辰达半导体); Supplier Footprint: SMA(DO-214AC); JLCPCB Part Class: Basic Part; Datasheet: https://atta.szlcsc.com/upload/public/pdf/source/20240710/2118BB86FDDB2E0B294389AC1F3F65C8.pdf; Supplier: LCSC; Diode Configuration: Independent Type; Forward Voltage (Vf@If): 550mV@3A; Reverse Voltage (Vr): 40V; Rectified Current: 3A; Reverse Leakage Current (Ir): 500uA@40V
J5 = 2.54-2*8P母: Holes Structure:2x8P Pitch:2.54mm Row Spacing:2.54mm Mounting Type:Straight Number of Rows:双排 Number of Holes:16P Insulation Height:- Contact Material:Brass Contact Plating:-; LCSC Part Name: 间距:2.54mm 2x8P 直插; Supplier Part: C30734; Manufacturer: BOOMELE(博穆精密); Supplier Footprint: 插件,P=2.54mm; JLCPCB Part Class: Extended Part; Datasheet: https://atta.szlcsc.com/upload/public/pdf/source/20230817/400B44B2F3F98035DBB6B63900A9163B.pdf; Supplier: LCSC; Holes Structure: 2x8P; Pitch: 2.54mm; Row Spacing: 2.54mm; Mounting Type: Straight; Number of Rows: 双排; Number of Holes: 16P; Contact Material: Brass
P2 = WJ500V-5.08-3P: Structure:1x3P Pitch:5.08mm Color:Green Mounting Style:Straight Current Rating (Max):18A Voltage Rating (Max):250V Number of Pins:3P Number of Rows:1 Wire Gauge - AWG:14~30 Wire Gauge - AWG:14~30 Wire Gauge - mm2:2.5 Wire Gauge - mm2:2.5 Number of PINs Pe; LCSC Part Name: 5.08mm 1x3P 排数:1 每排P数:3 直插; Supplier Part: C72334; Manufacturer: KANGNEX(康奈克斯电气); Supplier Footprint: 插件,P=5.08mm; JLCPCB Part Class: Extended Part; Datasheet: https://atta.szlcsc.com/upload/public/pdf/source/20191225/C72334_8A5EF831D67650233B6B1E3F2BC06274.pdf; Supplier: LCSC; Structure: 1x3P; Pitch: 5.08mm; Color: Green; Mounting Style: Straight; Current Rating (Max): 18A; Voltage Rating (Max): 250V; Number of Pins: 3P; Number of Rows: 1; Wire Gauge - AWG: 14~30; Wire Gauge - mm2: 2.5; Number of PINs Per Row: 3; Operating Temperature Range: -40℃~+105℃
Q10-Q12 = AO3400A_C20917: Type:1 N-Channel Drain Source Voltage (Vdss): Continuous Drain Current (Id): Drain Source On Resistance (RDS(on)@Vgs,Id):26.5mΩ@10V,5.7A Power Dissipation (Pd): Gate Threshold Voltage (Vgs(th)@Id):1.5V@250uA Total Gate Charge (Qg@Vgs):7nC@4.5V Input Capac; LCSC Part Name: 1个N沟道 耐压:30V 电流:5.7A; Supplier Part: C20917; Manufacturer: AOS; Supplier Footprint: SOT-23-3L; JLCPCB Part Class: Basic Part; Datasheet: https://atta.szlcsc.com/upload/public/pdf/source/20140107/1457706668533.pdf; Supplier: LCSC; Type: 1 N-Channel; Drain Source On Resistance (RDS(on)@Vgs,Id): 26.5mΩ@10V,5.7A; Gate Threshold Voltage (Vgs(th)@Id): 1.5V@250uA; Total Gate Charge (Qg@Vgs): 7nC@4.5V; Input Capacitance (Ciss@Vds): 630pF@15V; Operating Temperature: -55℃~+150℃@(Tj)
R254-R256 = 0402WGF1001TCE: Type:Thick Film Resistors Resistance:1kΩ Tolerance:±1% Tolerance:±1% Power(Watts): Overload Voltage (Max): Temperature Coefficient:±100ppm/℃ Temperature Coefficient:±100ppm/℃ Operating Temperature Range:-55℃~+155℃ Operating Temperature Range:-55℃~+155℃; LCSC Part Name: 1kΩ ±1% 62.5mW 厚膜电阻; Supplier Part: C11702; Manufacturer: UNI-ROYAL(厚声); Supplier Footprint: 0402; JLCPCB Part Class: Basic Part; Datasheet: https://atta.szlcsc.com/upload/public/pdf/source/20200306/C422600_1E6D84923E4A46A82E41ADD87F860B5C.pdf; Supplier: LCSC; Type: Thick Film Resistors; Tolerance: ±1%; Temperature Coefficient: ±100ppm/℃; Operating Temperature Range: -55℃~+155℃
SW10 = TS-1088-AR02016: Circuit:SPST Actuator Style:Round Button Operating Force:160gf Mounting Style:Brick nogging Switch Length:4mm Switch Width:3mm Switch Height:2mm Strike Gundam:不带 Contact Current:50mA Voltage Rating (DC):12V Insulation Resistance:100MΩ Actuator/Cap Color:B; LCSC Part Name: 4*3*2mm 立贴 轻触开关; Supplier Part: C720477; Manufacturer: XUNPU(讯普); Supplier Footprint: SMD; JLCPCB Part Class: Basic Part; Datasheet: https://atta.szlcsc.com/upload/public/pdf/source/20200810/C720475_60D09DD6C54279ADDB2DC25100F1CC11.pdf; Supplier: LCSC; Circuit: SPST; Actuator Style: Round Button; Operating Force: 160gf; Mounting Style: Brick nogging; Switch Length: 4mm; Switch Width: 3mm; Switch Height: 2mm; Strike Gundam: 不带; Contact Current: 50mA; Voltage Rating (DC): 12V; Insulation Resistance: 100MΩ; Actuator/Cap Color: Black; Pin Style: SMDSplicing; Mechanical Life: 10万次; Operating Temperature: -30℃~+80℃
TH1-TH3 = TOOLING_HOLE_JLCPCB
U22 = DS3231SN#T&R: Interface:I2C Voltage - Supply:2.3V~5.5V Voltage - Supply:2.3V~5.5V Operating Temperature:-40℃~+85℃ Operating Temperature:-40℃~+85℃; LCSC Part Name: 超高精度、I²C接口、集成RTC/TCXO/晶体; Supplier Part: C9866; Manufacturer: ADI(亚德诺)/MAXIM(美信); Supplier Footprint: SOIC-16-300mil; JLCPCB Part Class: Extended Part; Datasheet: https://atta.szlcsc.com/upload/public/pdf/source/20121112/1457706556491.pdf; Supplier: LCSC; Interface: I2C; Voltage - Supply: 2.3V~5.5V; Operating Temperature: -40℃~+85℃

## Nets
1.8V: C206.2 C208.1 C209.2 C211.2 Q1.1(G) Q2.1(G) R219.2 RN1.1 RN1.2 U13.8(VDDIO) U13.13(VDD) U14.2(VOUT)
3.3V: C207.2 C221.1 CARD1.4(VDD) H1.2 J5.1 LED7.1(A) Q6.1(G) Q7.1(G) Q8.1(G) Q9.1(G) R213.1 R214.1 R239.1 R242.1 R244.1 R246.1 R248.1 R257.2 R258.1 RN1.3 RN1.4 SW5.3 SW11.3 U11.2(VCC) U14.3(VIN) U18.2(OUTPUT) U22.2(VCC) ; also on sheet 1 3
7.4V: C220.1 C222.1 U18.3(INPUT) U19.3(INPUT) ; also on sheet 3
12V: C229.2 U17.3(OUT) ; also on sheet 3
20V: C225.1 C226.1 C227.1 C228.1 Q5.2(S) R237.1 U17.1(IN)
GND: C202.2 C203.1 C204.1 C205.2 C206.1 C207.1 C208.2 C209.1 C210.2 C211.1 C220.2 C221.2 C222.2 C223.2 C224.2 C225.2 C226.2 C227.2 C228.2 C229.1 C238.1 CARD1.6(VSS) CARD1.10 CARD1.11 CARD1.12 CARD1.13 H1.1 J1.1 LED5.2(-) LED6.2(K) Q10.2(S) Q11.2(S) Q12.2(S) R249.2 R250.2 R251.2 SW9.3 SW10.1 SW11.1 U9.25(GND) U11.1(GND) U12.3(GND) U12.12(GND) U13.18(GND) U13.20(RESV) U13.25(EP) U14.1(GND) U17.4(GND) U18.1(ADJ/GND) U19.1(ADJ/GND) U20.11(GND) U22.5(NC) U22.6(NC) U22.7(NC) U22.8(NC) U22.9(NC) U22.10(NC) U22.11(NC) U22.12(NC) U22.13(GND) USB3.1(GND) USB3.12(GND) USB3.13(SHELL) USB3.14(SHELL) ; also on sheet 1 2 3
PVBUS: Q5.3(D) R226.1 R228.1 USB3.2(VBUS) USB3.11(VBUS)
32KHZ: U22.1(32kHz)
A_GND1: D6.2(A) J5.14 Q10.3(D)
A_GND2: D7.2(A) J5.13 Q11.3(D)
A_GND3: D8.2(A) P2.1 Q12.3(D)
AUX_SCL: U13.7(AUX_CL)
AUX_SDA: U13.21(AUX_DA)
BLA: J1.8 R213.2 U9.32(BLA) ; also on sheet 1
CC1: U20.4(CC1) USB3.4(CC1)
CC2: U20.5(CC2) USB3.10(CC2)
CD: CARD1.CD R239.2 R240.1
CR_3V: C204.2 C205.1 U12.5(V_BCKP) U22.14(VBAT) ; also on sheet 3
CS: J1.7 U9.31(CS) ; also on sheet 1
CS2: CARD1.2(CD/DAT3) ; also on sheet 1
DC: J1.6 U9.30(RS) ; also on sheet 1
DI: CARD1.3(CMD) J1.4 U9.28(SDA) ; also on sheet 1
DO: CARD1.7(DAT0) ; also on sheet 1
ESP_3.3V: C223.1 U19.2(OUTPUT) ; also on sheet 2
EXTV: J5.2 R241.1 R243.1 R245.1 R247.1
FCS: J1.10 R214.2 U9.34(FCS)
FSYNC: U13.11(FSYNC)
G_VCC: C202.1 C203.2 SW5.2 U12.4(VCC)
GPIO12: U12.1(RXD1) ; also on sheet 1
GPIO13: U12.2(TXD1) ; also on sheet 1
GPIO14: SW10.2 ; also on sheet 1
GPIO15: SW9.2 ; also on sheet 1
GPIO16: R238.1 ; also on sheet 1
GPIO18: CARD1.5(CLX) J1.3 U9.27(SCL) ; also on sheet 1
GPIO36: H1.4 Q2.2(S) R258.2 RN1.6 U11.4(SDA) U22.15(SDA) ; also on sheet 1 3
GPIO37: H1.3 Q1.2(S) R257.1 RN1.5 U11.3(SCL) U22.16(SCL) ; also on sheet 1 3
GPIO39: J1.5 U9.29(RSR) ; also on sheet 1
ICM-CS: U13.22(nCS)
IN_N0: J5.3 Q6.2(S) R242.2
IN_N1: J5.5 Q7.2(S) R244.2
IN_N2: J5.7 Q8.2(S) R246.2
IN_N3: J5.9 Q9.2(S) R248.2
INT_1.8V: U13.12(INT1)
OUT_N0: J5.4 Q6.3(D) R241.2
OUT_N1: J5.6 Q7.3(D) R243.2
OUT_N2: J5.8 Q8.3(D) R245.2
OUT_N3: J5.10 Q9.3(D) R247.2
PD+: U20.2(D+) USB3.6(DP1) USB3.8(DP2)
PD-: U20.3(D-) USB3.5(DN2) USB3.7(DN1)
PWR_1: D6.1(K) J5.16
PWR_2: D7.1(K) J5.15
PWR_3: D8.1(K) P2.3
REGOUT: C210.1 U13.10(REGOUT)
RTC_RST: U22.4(RST)
SCL_1.8V: Q1.3(D) RN1.7 U13.23(SCL/SCLK)
SDA_1.8V: Q2.3(D) RN1.8 U13.24(SDA/SDI)
SDO/ADR_1.8V: R219.1 U13.9(SDO/AD0)
SIG_1: J5.12 R249.1 R254.1
SIG_2: J5.11 R250.1 R255.1
SIG_3: P2.2 R251.1 R256.1
SQW: U22.3(INTSQW)
$4N6616: LED7.2(K) R240.2
$6N1012: C224.1 R226.2 U20.1(VIN)
$6N1017: R227.2 U20.10(GATE)
$6N1018: Q5.1(G) R227.1 R228.2
$6N3165: LED5.1(+) R237.2
$7N234: LED6.1(A) R238.2
$7N4903: Q10.1(G) R254.2
$7N4945: Q11.1(G) R255.2
$7N4985: Q12.1(G) R256.2
Net-(C238-2): C238.2 J1.2 SW11.2 U9.26(VCC)
Net-(J1-9): J1.9 U9.33(FS0)

Not connected (* = marked no-connect by the designer): CARD1 1(DAT2)* 8(DAT1)*; SW5 1 4 5; SW9 1 4 5; SW11 4 5; U9 1(CS) 2(RS) 3(WR) 4(AD) 5(RST) 6(D0) 7(D1) 8(D2) 9(D3) 10(D4) 11(D5) 12(D6) 13(D7) 14(D8) 15(D9) 16(D10) 17(D11) 18(D12) 19(D13) 20(D14) 21(D15) 22(GND) 23(BLK) 24(VCC); U12 6(1PPS)* 7(RESERVED)* 8(RESERVED)* 9(NC)* 10(RESET)* 11(RESERVED)*; U13 1(NC)* 2(NC)* 3(NC)* 4(NC)* 5(NC)* 6(NC)* 14(NC)* 15(NC)* 16(NC)* 17(NC)* 19(RESV); U20 6(SDA) 7(SCL) 8(VSET) 9(ISET); USB3 3(SBU2)* 9(SBU1)*

## Notes on the sheets
sheet 4
- SCREENS
  & Storage
sheet 5
- GPS & IMU
sheet 6
- POWER RAILS
- 12V stuff
- BAT LDOs
sheet 7
- USER & MISC.
